# Altium schematic sheet Microcontroller.SchDoc
size A2; Organization: Altium Limited; Address1: L3, 12a Rodborough Rd; Address2: Frenchs Forest; Address3: NSW; Address4: Australia 2086
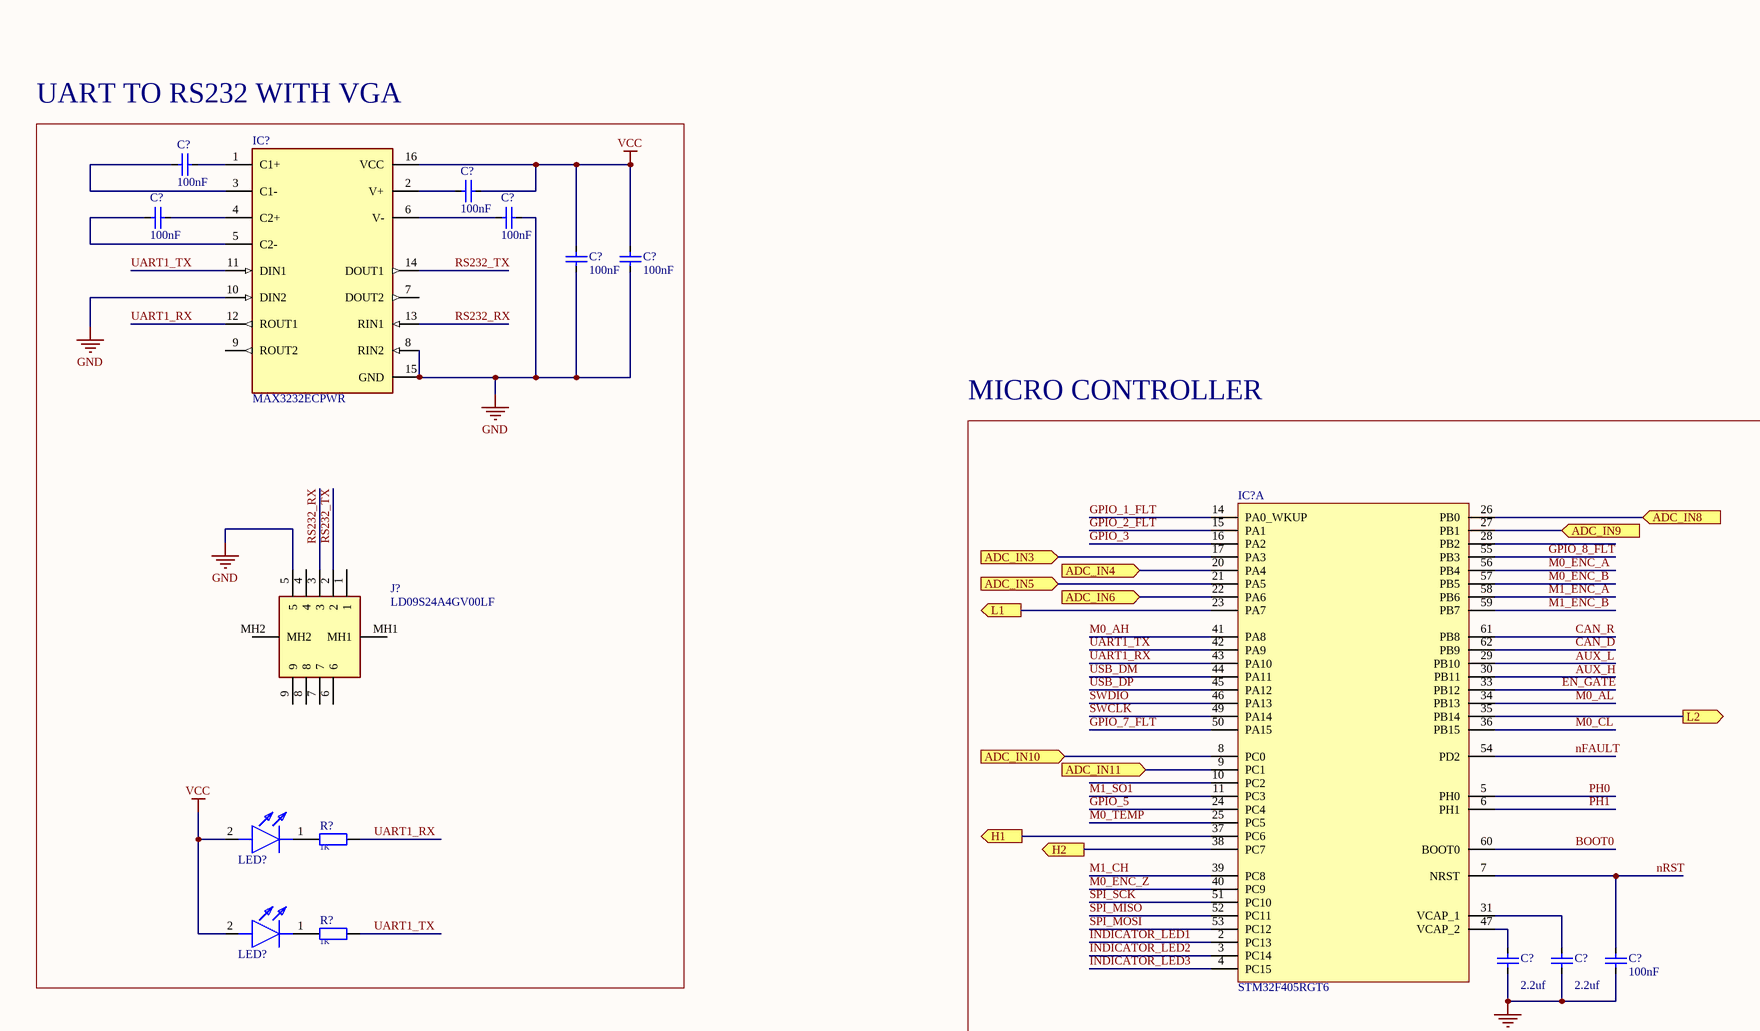
[diagram p0: Microcontroller.SchDoc, top left]
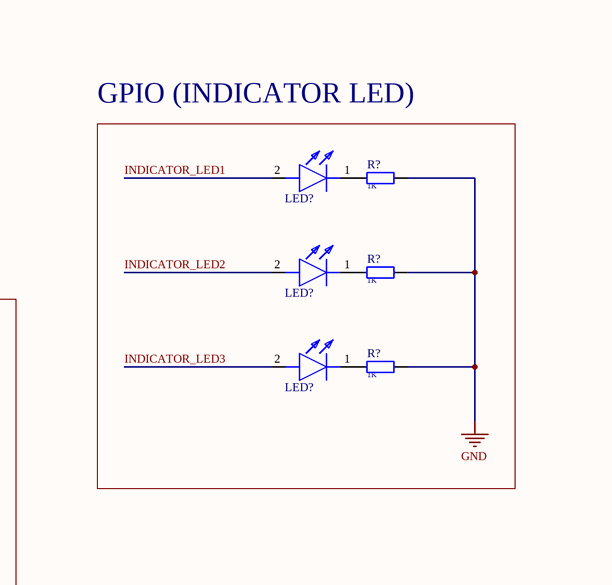
[diagram p1: Microcontroller.SchDoc, top right]
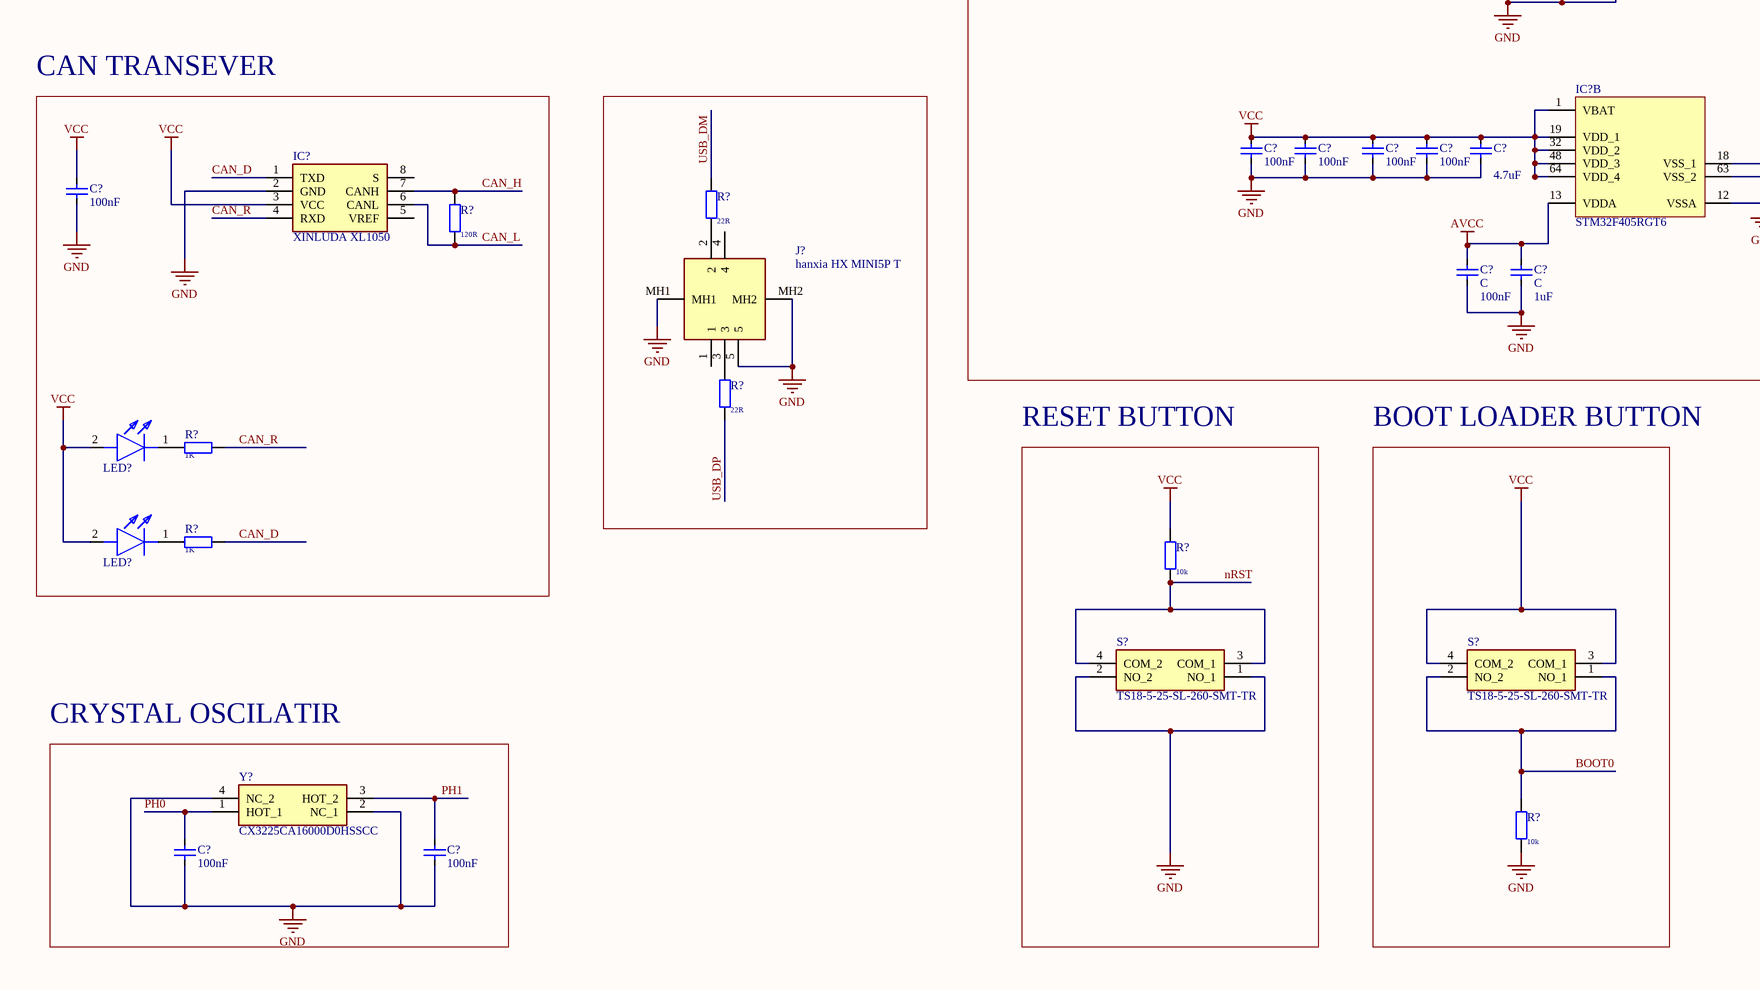
[diagram p2: Microcontroller.SchDoc, bottom left]
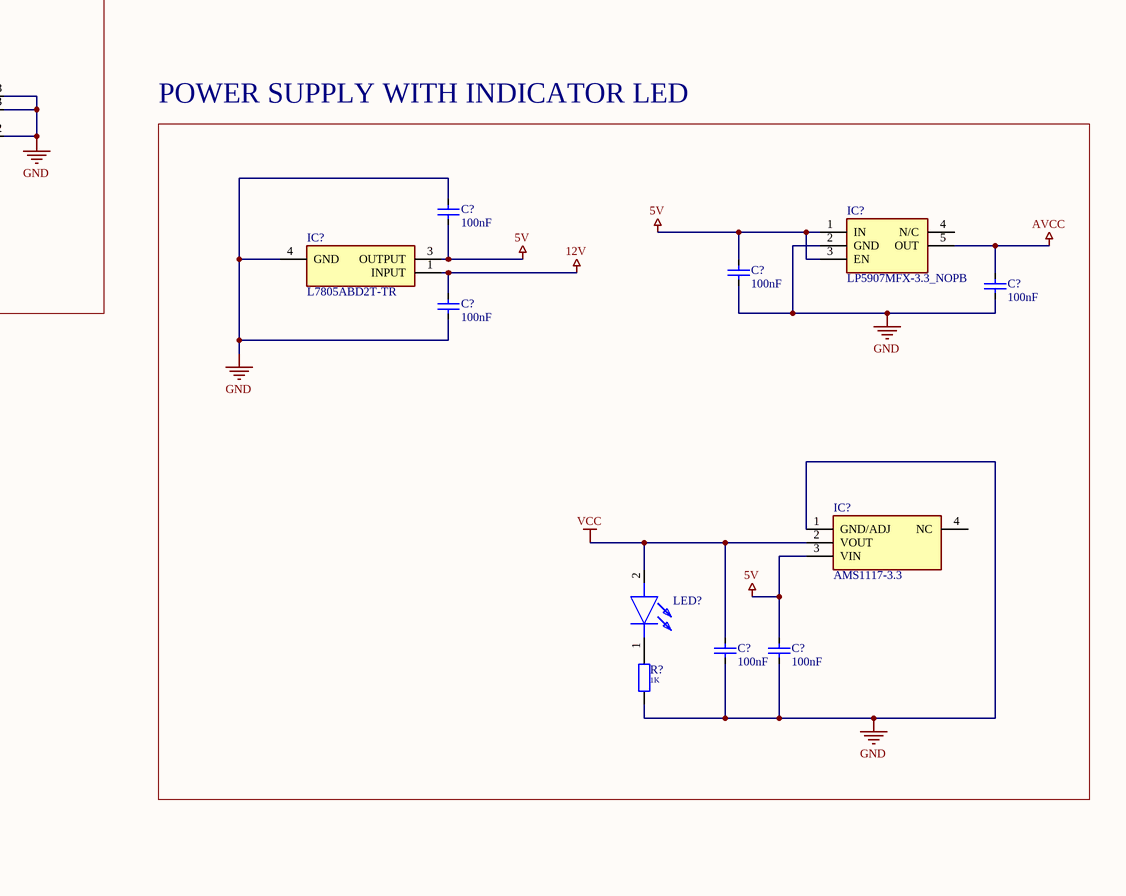
[diagram p3: Microcontroller.SchDoc, bottom right]

## Parts
(Parts that share a designator on the sheet are numbered #1, #2 ... from top to bottom, then left to right.)
C?#1  value 100nF  [CAPC3216X18N]  (hidden comment: C)
C?#2  value 100nF  [CAPC3216X18N]  (hidden comment: C)
C?#3  value 100nF  [CAPC3216X18N]  (hidden comment: C)
C?#4  value 100nF  [CAPC3216X18N]  (hidden comment: C)
C?#5  value 100nF  [CAPC3216X18N]  (hidden comment: C)
C?#6  value 100nF  [CAPC3216X18N]  (hidden comment: C)
C?#7  value 2.2uf  [CAPC1608X09N]  (hidden comment: C)
C?#8  value 2.2uf  [CAPC1608X09N]  (hidden comment: C)
C?#9  value 100nF  [CAPC3216X18N]  (hidden comment: C)
C?#10  value 100nF  [CAPC3216X18N]  (hidden comment: C)
C?#11  value 100nF  [CAPC3216X18N]  (hidden comment: C)
C?#12  value 100nF  [CAPC3216X18N]  (hidden comment: C)
C?#13  value 100nF  [CAPC3216X18N]  (hidden comment: C)
C?#14  value 4.7uF  [CAPC1608X09N]  (hidden comment: C)
C?#15  value 100nF  [CAPC3216X18N]  (hidden comment: C)
C?#16  C  value 100nF  [CAPC1608X09N]
C?#17  C  value 1uF  [CAPC1608X09N]
C?#18  value 100nF  [CAPC3216X18N]  (hidden comment: C)
C?#19  value 100nF  [CAPC3216X18N]  (hidden comment: C)
C?#20  value 100nF  [CAPC3216X18N]  (hidden comment: C)
C?#21  value 100nF  [CAPC3216X18N]  (hidden comment: C)
C?#22  value 100nF  [CAPC3216X18N]  (hidden comment: C)
C?#23  value 100nF  [CAPC3216X18N]  (hidden comment: C)
C?#24  value 100nF  [CAPC3216X18N]  (hidden comment: C)
C?#25  value 100nF  [CAPC3216X18N]  (hidden comment: C)
IC?#1  MAX3232ECPWR  [SOP65P640X120-16N]
IC?#2  STM32F405RGT6  [QFP50P1200X1200X160-64N]  (part A of 2)
IC?#3  STM32F405RGT6  [QFP50P1200X1200X160-64N]  (part B of 2)
IC?#4  XINLUDA XL1050  [SOIC127P600X175-8N]
IC?#5  LP5907MFX-3.3_NOPB  [SOT95P280X145-5N]
IC?#6  L7805ABD2T-TR  [D2PAK-STB35NF10T4]
IC?#7  AMS1117-3.3  [SOT229P700X180-4N]
J?#1  LD09S24A4GV00LF  [LD09S24A4GV00LF]
J?#2  hanxia HX MINI5P T  [10119313301TLF]
LED?#1  LTST-C190KGKT  [LEDC1608X80N]  (value not drawn)
LED?#2  LTST-C190KGKT  [LEDC1608X80N]  (value not drawn)
LED?#3  LTST-C190KGKT  [LEDC1608X80N]  (value not drawn)
LED?#4  LTST-C190KGKT  [LEDC1608X80N]  (value not drawn)
LED?#5  LTST-C190KGKT  [LEDC1608X80N]  (value not drawn)
LED?#6  LTST-C190KGKT  [LEDC1608X80N]  (value not drawn)
LED?#7  LTST-C190KGKT  [LEDC1608X80N]  (value not drawn)
LED?#8  LTST-C190KGKT  [LEDC1608X80N]  (value not drawn)
R?#1  value 1K  [RESC1608X06N]  (hidden comment: R)
R?#2  value 1K  [RESC1608X06N]  (hidden comment: R)
R?#3  value 1K  [RESC1608X06N]  (hidden comment: R)
R?#4  value 1K  [RESC1608X06N]  (hidden comment: R)
R?#5  value 1K  [RESC1608X06N]  (hidden comment: R)
R?#6  value 22R  [RESC1608X06N]  (hidden comment: R)
R?#7  value 120R  [RESC1005X04N]  (hidden comment: R)
R?#8  value 22R  [RESC1608X06N]  (hidden comment: R)
R?#9  value 1K  [RESC1608X06N]  (hidden comment: R)
R?#10  value 1K  [RESC1608X06N]  (hidden comment: R)
R?#11  value 10k  [RESC1608X06N]  (hidden comment: R)
R?#12  value 1K  [RESC1608X06N]  (hidden comment: R)
R?#13  value 10k  [RESC1608X06N]  (hidden comment: R)
S?#1  TS18-5-25-SL-260-SMT-TR  [TS18525SL260SMTTR]
S?#2  TS18-5-25-SL-260-SMT-TR  [TS18525SL260SMTTR]
Y?  CX3225CA16000D0HSSCC  [CX3225CA16000D0HSSCC]

## Blocks framed on the sheet
UART TO RS232 WITH VGA: C?#1-C?#6 IC?#1 J?#1 LED?#4 LED?#5 R?#4 R?#5
GPIO (INDICATOR LED): LED?#1-LED?#3 R?#1-R?#3
MICRO CONTROLLER: C?#7-C?#14 C?#16 C?#17 IC?#2 IC?#3
CAN TRANSEVER: C?#15 IC?#4 LED?#6 LED?#7 R?#7 R?#9 R?#10
POWER SUPPLY WITH INDICATOR LED: C?#18-C?#23 IC?#5-IC?#7 LED?#8 R?#12
RESET BUTTON: R?#11 S?#1
BOOT LOADER BUTTON: R?#13 S?#2
CRYSTAL OSCILATIR: C?#24 C?#25 Y?

## Ports
ADC_IN3 (in), ADC_IN4 (in), ADC_IN5 (in), ADC_IN6 (in), ADC_IN8 (in), ADC_IN9 (in), ADC_IN10 (in), ADC_IN11 (in), H1 (out), H2 (out), L1 (out), L2 (out)

## Nets
5V: C?#18.1 C?#19.2 C?#23.2 IC?#5.1(IN) IC?#5.3(EN) IC?#6.3(OUTPUT) IC?#7.3(VIN)
12V: C?#21.2 IC?#6.1(INPUT)
AVCC: C?#16.2 C?#17.2 C?#20.2 IC?#3.13(VDDA) IC?#5.5(OUT)
GND: C?#4.1 C?#5.1 C?#6.1 C?#7.1 C?#8.1 C?#9.1 C?#10.1 C?#11.1 C?#12.1 C?#13.1 C?#14.1 C?#15.1 C?#16.1 C?#17.1 C?#18.2 C?#19.1 C?#20.1 C?#21.1 C?#22.1 C?#23.1 C?#24.1 C?#25.1 IC?#1.8(RIN2) IC?#1.10(DIN2) IC?#1.15(GND) IC?#3.12(VSSA) IC?#3.18(VSS_1) IC?#3.63(VSS_2) IC?#4.2(GND) IC?#5.2(GND) IC?#6.4(GND) IC?#7.1(GND/ADJ) J?#1.5 J?#2.5 J?#2.MH1 J?#2.MH2 R?#1.2 R?#2.2 R?#3.2 R?#12.2 R?#13.1 S?#1.1(NO_1) S?#1.2(NO_2) Y?.2(NC_1) Y?.4(NC_2)
VCC: C?#2.1 C?#5.2 C?#6.2 C?#10.2 C?#11.2 C?#12.2 C?#13.2 C?#14.2 C?#15.2 C?#22.2 IC?#1.16(VCC) IC?#3.1(VBAT) IC?#3.19(VDD_1) IC?#3.32(VDD_2) IC?#3.48(VDD_3) IC?#3.64(VDD_4) IC?#4.3(VCC) IC?#7.2(VOUT) LED?#4.2(A) LED?#5.2(A) LED?#6.2(A) LED?#7.2(A) LED?#8.2(A) R?#11.2 S?#2.3(COM_1) S?#2.4(COM_2)
ADC_IN3: IC?#2.17(PA3) ; port ADC_IN3
ADC_IN4: IC?#2.20(PA4) ; port ADC_IN4
ADC_IN5: IC?#2.21(PA5) ; port ADC_IN5
ADC_IN6: IC?#2.22(PA6) ; port ADC_IN6
ADC_IN8: IC?#2.26(PB0) ; port ADC_IN8
ADC_IN9: IC?#2.27(PB1) ; port ADC_IN9
ADC_IN10: IC?#2.8(PC0) ; port ADC_IN10
ADC_IN11: IC?#2.9(PC1) ; port ADC_IN11
AUX_L: IC?#2.29(PB10)
BOOT0: IC?#2.60(BOOT0) R?#13.2 S?#2.1(NO_1) S?#2.2(NO_2)
CAN_D: IC?#2.62(PB9) IC?#4.1(TXD) R?#10.1
CAN_H: IC?#4.7(CANH) R?#7.2
CAN_L: IC?#4.6(CANL) R?#7.1
CAN_R: IC?#2.61(PB8) IC?#4.4(RXD) R?#9.1
EN_GATE: IC?#2.33(PB12)
GPIO_1_FLT: IC?#2.14(PA0_WKUP)
GPIO_2_FLT: IC?#2.15(PA1)
GPIO_3: IC?#2.16(PA2)
GPIO_5: IC?#2.24(PC4)
GPIO_7_FLT: IC?#2.50(PA15)
GPIO_8_FLT: IC?#2.55(PB3)
H1: IC?#2.37(PC6) ; port H1
H2: IC?#2.38(PC7) ; port H2
INDICATOR_LED1: IC?#2.2(PC13) LED?#1.2(A)
INDICATOR_LED2: IC?#2.3(PC14) LED?#2.2(A)
INDICATOR_LED3: IC?#2.4(PC15) LED?#3.2(A)
L1: IC?#2.23(PA7) ; port L1
L2: IC?#2.35(PB14) ; port L2
M0_AH: IC?#2.41(PA8)
M0_AL: IC?#2.34(PB13)
M0_CL: IC?#2.36(PB15)
M0_ENC_A: IC?#2.56(PB4)
M0_ENC_B: IC?#2.57(PB5)
M0_ENC_Z: IC?#2.40(PC9)
M0_TEMP: IC?#2.25(PC5)
M1_CH: IC?#2.39(PC8)
M1_ENC_A: IC?#2.58(PB6)
M1_ENC_B: IC?#2.59(PB7)
M1_SO1: IC?#2.11(PC3)
nFAULT: IC?#2.54(PD2)
nRST: C?#9.2 IC?#2.7(NRST) R?#11.1 S?#1.3(COM_1) S?#1.4(COM_2)
PH0: C?#24.2 IC?#2.5(PH0) Y?.1(HOT_1)
PH1: C?#25.2 IC?#2.6(PH1) Y?.3(HOT_2)
RS232_RX: IC?#1.13(RIN1) J?#1.3
RS232_TX: IC?#1.14(DOUT1) J?#1.2
SPI_MISO: IC?#2.52(PC11)
SPI_MOSI: IC?#2.53(PC12)
SPI_SCK: IC?#2.51(PC10)
SWCLK: IC?#2.49(PA14)
SWDIO: IC?#2.46(PA13)
UART1_RX: IC?#1.12(ROUT1) IC?#2.43(PA10) R?#4.1
UART1_TX: IC?#1.11(DIN1) IC?#2.42(PA9) R?#5.1
USB_DM: IC?#2.44(PA11) R?#6.2
USB_DP: IC?#2.45(PA12) R?#8.1
NetC?#1_1: C?#1.1 IC?#1.3(C1-)
NetC?#1_2: C?#1.2 IC?#1.1(C1+)
NetC?#2_2: C?#2.2 IC?#1.2(V+)
NetC?#3_1: C?#3.1 IC?#1.4(C2+)
NetC?#3_2: C?#3.2 IC?#1.5(C2-)
NetC?#4_2: C?#4.2 IC?#1.6(V-)
NetC?#7_2: C?#7.2 IC?#2.47(VCAP_2)
NetC?#8_2: C?#8.2 IC?#2.31(VCAP_1)
NetJ?#2_2: J?#2.2 R?#6.1
NetJ?#2_3: J?#2.3 R?#8.2
NetLED?#1_1: LED?#1.1(K) R?#1.1
NetLED?#2_1: LED?#2.1(K) R?#2.1
NetLED?#3_1: LED?#3.1(K) R?#3.1
NetLED?#4_1: LED?#4.1(K) R?#4.2
NetLED?#5_1: LED?#5.1(K) R?#5.2
NetLED?#6_1: LED?#6.1(K) R?#9.2
NetLED?#7_1: LED?#7.1(K) R?#10.2
NetLED?#8_1: LED?#8.1(K) R?#12.1

Not connected (* = marked no-connect by the designer): IC?#1 7(DOUT2) 9(ROUT2); IC?#2 10(PC2) 28(PB2) 30(PB11); IC?#4 5(VREF) 8(S); IC?#5 4(N/C); IC?#7 4(NC); J?#1 1 4 6 7 8 9 MH1 MH2; J?#2 1 4

## Notes on the sheet
- Labels drawn without touching a wire or pin: AUX_H
- Title
- Size:
- Date:
- File:
- A2
- Number:
- Time:
- Revision:
- Sheet
- of

## Library data of the parts
C?#1-C?#6 C?#9-C?#13 C?#15 C?#18-C?#25 = C: Parameter 2: 06033C104KAT4A; Link: https://www.lcsc.com/product-detail/Multilayer-Ceramic-Capacitors-MLCC-SMD-SMT_Kyocera-AVX-06033C104KAT4A_C2167104.html
C?#7 C?#8 = C: MPN: 0603B225K250NT; Link: https://www.lcsc.com/product-detail/Multilayer-Ceramic-Capacitors-MLCC-SMD-SMT_FH-Guangdong-Fenghua-Advanced-Tech-0603B225K250NT_C99228.html
C?#14 = C: MPN: CS3216X7R475K160NRI; Link: https://www.lcsc.com/product-detail/Multilayer-Ceramic-Capacitors-MLCC-SMD-SMT_Samwha-Capacitor-CS3216X7R475K160NRI_C5189824.html
C?#17 = C: MPN: CL10B105KP8NNNC; Link: https://www.lcsc.com/product-detail/Multilayer-Ceramic-Capacitors-MLCC-SMD-SMT_Samsung-Electro-Mechanics-CL10B105KP8NNNC_C95843.html
IC?#1 = MAX3232ECPWR: Integrated Circuit; Manufacturer_Name: Texas Instruments; Datasheet Link: http://www.ti.com/general/docs/lit/getliterature.tsp?genericPartNumber=MAX3232E&fileType=pdf&HQS=ti-null-null-sf-df-pf-sep-wwe&DCM=yes; Height: 1.2mm; Manufacturer_Part_Number: MAX3232ECPWR; Mouser Part Number: 595-MAX3232ECPWR; Mouser Price/Stock: https://www.mouser.co.uk/ProductDetail/Texas-Instruments/MAX3232ECPWR?qs=paYhMW8qfis8NsHohmO7ng%3D%3D; Arrow Part Number: MAX3232ECPWR; Arrow Price/Stock: https://www.arrow.com/en/products/max3232ecpwr/texas-instruments?region=nac
IC?#2 IC?#3 = STM32F405RGT6: Integrated Circuit; Manufacturer_Name: STMicroelectronics; Datasheet Link: http://www.st.com/web/en/resource/technical/document/datasheet/DM00037051.pdf; Height: 1.6mm; Manufacturer_Part_Number: STM32F405RGT6; Mouser Part Number: 511-STM32F405RGT6; Mouser Price/Stock: https://www.mouser.co.uk/ProductDetail/STMicroelectronics/STM32F405RGT6?qs=Z8%252BeY1k3TIKgj7QWsYGpQw%3D%3D; Arrow Part Number: STM32F405RGT6; Arrow Price/Stock: https://www.arrow.com/en/products/stm32f405rgt6/stmicroelectronics?utm_currency=USD&region=nac
IC?#4 = TJA1050T_CM: Integrated Circuit; Manufacturer_Name: NXP; Datasheet Link: https://www.lcsc.com/product-detail/CAN-Transceivers_XINLUDA-XL1050_C609746.html; Height: 1.75mm; Manufacturer_Part_Number: XINLUDA XL1050; Mouser Part Number: N/A; Mouser Price/Stock: https://www.mouser.co.uk/ProductDetail/NXP-Semiconductors/TJA1050T-CM?qs=fAHHVMwC%252BbibiWs27gP5ng%3D%3D
IC?#5 = LP5907MFX-3.3_NOPB: Integrated Circuit; Manufacturer_Name: Texas Instruments; Manufacturer_Part_Number: LP5907MFX-3.3/NOPB; Datasheet Link: https://datasheet.datasheetarchive.com/originals/distributors/Datasheets-SFU2/DSASFU100037200.pdf; Height: 1.45mm; Mouser Part Number: 595-LP5907MFX-3.3NPB; Mouser Price/Stock: https://www.mouser.co.uk/ProductDetail/Texas-Instruments/LP5907MFX-3.3-NOPB?qs=biyDIajrTn6NhrJCoL%2FdSQ%3D%3D; Arrow Part Number: LP5907MFX-3.3/NOPB; Arrow Price/Stock: https://www.arrow.com/en/products/lp5907mfx-3.3nopb/texas-instruments?utm_currency=USD&region=nac
IC?#6 = L7805ABD2T-TR: Integrated Circuit; Manufacturer_Name: STMicroelectronics; Datasheet Link: https://www.st.com/resource/en/datasheet/l78.pdf; Manufacturer_Part_Number: L7805ABD2T-TR; Mouser Part Number: 511-L7805ABD2T-TR; Mouser Price/Stock: https://www.mouser.co.uk/ProductDetail/STMicroelectronics/L7805ABD2T-TR?qs=LL%252BsqOK9SqOQ%2FfZD5ZsNqA%3D%3D; Arrow Part Number: L7805ABD2T-TR; Arrow Price/Stock: https://www.arrow.com/en/products/l7805abd2t-tr/stmicroelectronics?utm_currency=USD&region=nac
IC?#7 = AMS1117-3.3: Integrated Circuit; Manufacturer_Name: Advanced; Datasheet Link: https://datasheet.datasheetarchive.com/originals/distributors/Datasheets-28/DSA-550594.pdf; Height: 1.8mm; Manufacturer_Part_Number: AMS1117-3.3
J?#1 = LD09S24A4GV00LF: Connector; Manufacturer_Name: Amphenol Communications Solutions; Datasheet Link: https://cdn.amphenol-cs.com/media/wysiwyg/files/drawing/10130912.pdf; Height: 12.39mm; Manufacturer_Part_Number: LD09S24A4GV00LF; Arrow Part Number: LD09S24A4GV00LF; Arrow Price/Stock: https://www.arrow.com/en/products/ld09s24a4gv00lf/amphenol-fci?utm_currency=USD&region=nac
J?#2 = 10119313-301TLF: Connector; Manufacturer_Name: Amphenol; Datasheet Link: https://www.lcsc.com/product-detail/USB-Connectors_hanxia-HX-MINI5P-T_C19189146.html; Height: 9.7mm; Manufacturer_Part_Number: hanxia HX MINI5P T; Mouser Part Number: 649-10119313-301TLF; Mouser Price/Stock: https://www.mouser.co.uk/ProductDetail/Amphenol-FCI/10119313-301TLF?qs=QcFhgjUTvvrAeUuachPUXg%3D%3D
LED?#1 = LTST-C190KGKT: LED; Manufacturer_Name: Lite-On; Manufacturer_Part_Number: 19-217UYOC/S3112/TR8; Datasheet Link: https://www.lcsc.com/datasheet/lcsc_datasheet_2004131606_Everlight-Elec-19-217UYOC-S3112-TR8_C264473.pdf; Height: 0.8mm; Lcsc Part Number: C965799; Lcsc Price/Stock: https://www.lcsc.com/product-detail/LED-Indication-Discrete_Everlight-Elec-19-217UYOC-S3112-TR8_C264473.html; Arrow Part Number: LTST-C190KGKT; Arrow Price/Stock: https://www.arrow.com/en/products/ltst-c190kgkt/lite-on-technology?region=europe
LED?#2 = LTST-C190KGKT: LED; Manufacturer_Name: Lite-On; Manufacturer_Part_Number: XL-1608UGC-04; Datasheet Link: https://www.lcsc.com/datasheet/lcsc_datasheet_2402181505_XINGLIGHT-XL-1608UGC-04_C965804.pdf; Height: 0.8mm; Lcsc Part Number: C965799; Lcsc Price/Stock: https://www.lcsc.com/product-detail/LED-Indication-Discrete_XINGLIGHT-XL-1608UGC-04_C965804.html; Arrow Part Number: LTST-C190KGKT; Arrow Price/Stock: https://www.arrow.com/en/products/ltst-c190kgkt/lite-on-technology?region=europe
LED?#3 LED?#5 LED?#7 = LTST-C190KGKT: LED; Manufacturer_Name: Lite-On; Manufacturer_Part_Number: XL-1608UBC-04; Height: 0.8mm; Arrow Part Number: LTST-C190KGKT; Arrow Price/Stock: https://www.arrow.com/en/products/ltst-c190kgkt/lite-on-technology?region=europe
  LED?#3: Datasheet Link: https://www.lcsc.com/datasheet/lcsc_datasheet_2402181505_XINGLIGHT-XL-1608UBC-04_C965807.pdf; Lcsc Part Number: C965799; Lcsc Price/Stock: https://www.lcsc.com/product-detail/LED-Indication-Discrete_XINGLIGHT-XL-1608UBC-04_C965807.html
  LED?#5 LED?#7: Datasheet Link: http://uk.rs-online.com/web/p/visible-leds/6920988/; Mouser Part Number: 859-LTST-C190KGKT; Mouser Price/Stock: https://www.mouser.co.uk/ProductDetail/Lite-On/LTST-C190KGKT?qs=205qCy6M2Q%252BAdcgwUZktqw%3D%3D; Link: https://www.lcsc.com/product-detail/LED-Indication-Discrete_XINGLIGHT-XL-1608UBC-04_C965807.html
LED?#4 LED?#6 = LTST-C190KGKT: LED; Manufacturer_Name: Lite-On; Manufacturer_Part_Number: XL-1608PGC-06; Datasheet Link: http://uk.rs-online.com/web/p/visible-leds/6920988/; Height: 0.8mm; Mouser Part Number: 859-LTST-C190KGKT; Mouser Price/Stock: https://www.mouser.co.uk/ProductDetail/Lite-On/LTST-C190KGKT?qs=205qCy6M2Q%252BAdcgwUZktqw%3D%3D; Arrow Part Number: LTST-C190KGKT; Arrow Price/Stock: https://www.arrow.com/en/products/ltst-c190kgkt/lite-on-technology?region=europe; Link: https://www.lcsc.com/product-detail/LED-Indication-Discrete_XINGLIGHT-XL-1608PGC-06_C7371905.html
LED?#8 = LTST-C190KGKT: LED; Manufacturer_Name: Lite-On; Datasheet Link: http://uk.rs-online.com/web/p/visible-leds/6920988/; Height: 0.8mm; Manufacturer_Part_Number: LTST-C190KGKT; Mouser Part Number: 859-LTST-C190KGKT; Mouser Price/Stock: https://www.mouser.co.uk/ProductDetail/Lite-On/LTST-C190KGKT?qs=205qCy6M2Q%252BAdcgwUZktqw%3D%3D; Arrow Part Number: LTST-C190KGKT; Arrow Price/Stock: https://www.arrow.com/en/products/ltst-c190kgkt/lite-on-technology?region=europe
R?#1-R?#5 R?#12 = R: MPN: 0603WAF1001T5E; Link: https://www.lcsc.com/product-detail/Chip-Resistor-Surface-Mount_UNI-ROYAL-Uniroyal-Elec-0603WAF1001T5E_C21190.html
R?#6 R?#8 = R: MPN: 0603WAF220JT5E; Link: https://www.lcsc.com/product-detail/Chip-Resistor-Surface-Mount_UNI-ROYAL-Uniroyal-Elec-0603WAF220JT5E_C23345.html
R?#7 = R: MPN: 0603WAF1200T5E; Link: https://www.lcsc.com/product-detail/Chip-Resistor-Surface-Mount_UNI-ROYAL-Uniroyal-Elec-0603WAF1200T5E_C22787.html
R?#9 R?#10 = R: MPN: RT0603FRD071KL; Link: https://www.lcsc.com/product-detail/Chip-Resistor-Surface-Mount_YAGEO-RT0603FRD071KL_C136938.html
R?#11 R?#13 = R: MPN: RC0603FR-0710KL; Link: https://www.lcsc.com/product-detail/Chip-Resistor-Surface-Mount_YAGEO-RC0603FR-0710KL_C98220.html
S?#1 S?#2 = TS18-5-25-SL-260-SMT-TR: Switch; Manufacturer_Name: Same Sky; Datasheet Link: https://www.sameskydevices.com/product/resource/supplyframepdf/ts18.pdf; Height: 2.7mm; Manufacturer_Part_Number: TS18-5-25-SL-260-SMT-TR; Mouser Part Number: 179-TS18525SL260SMTT; Mouser Price/Stock: https://www.mouser.co.uk/ProductDetail/Same-Sky/TS18-5-25-SL-260-SMT-TR?qs=tlsG%2FOw5FFh0yS4gYnfcwg%3D%3D
Y? = CX3225CA16000D0HSSCC: Crystal or Oscillator; Manufacturer_Name: Kyocera AVX; Datasheet Link: https://media.digikey.com/pdf/Data%20Sheets/AVX%20PDFs/CX3225CA_%20Series_Spec.pdf; Height: 0.9mm; Manufacturer_Part_Number: CX3225CA16000D0HSSCC; Mouser Part Number: N/A; Mouser Price/Stock: https://www.mouser.co.uk/ProductDetail/Kyocera-Electronic-Components/CX3225CA16000D0HSSCC?qs=A6eO%252BMLsxmRcoOtVnFyCOA%3D%3D; Arrow Part Number: CX3225CA16000D0HSSCC; Arrow Price/Stock: https://www.arrow.com/en/products/cx3225ca16000d0hsscc/kyocera
C?#16 = C: Parameter 2: *; Link: *